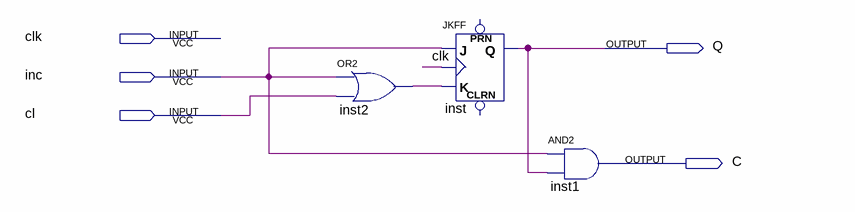
[diagram p0: schematic sheet]
// Quartus schematic REG1_INC_CL.bdf as structural Verilog: 3 symbols, 5 pins
module REG1_INC_CL (
  input  clk,
  input  inc,
  input  cl,
  output Q,
  output C
);

  wire inst2_out;

  or inst2 (inst2_out, inc, cl);
  JKFF inst (.K(inst2_out), .J(inc), .CLK(clk), .Q(Q));  // open: PRN, CLRN
  and inst1 (C, inc, Q);
endmodule
